# EAGLE design ASD2302 (EAGLE 6.3)
DATABASE: ./../../../../../Components/TinyCircuits_Part_Database.txt
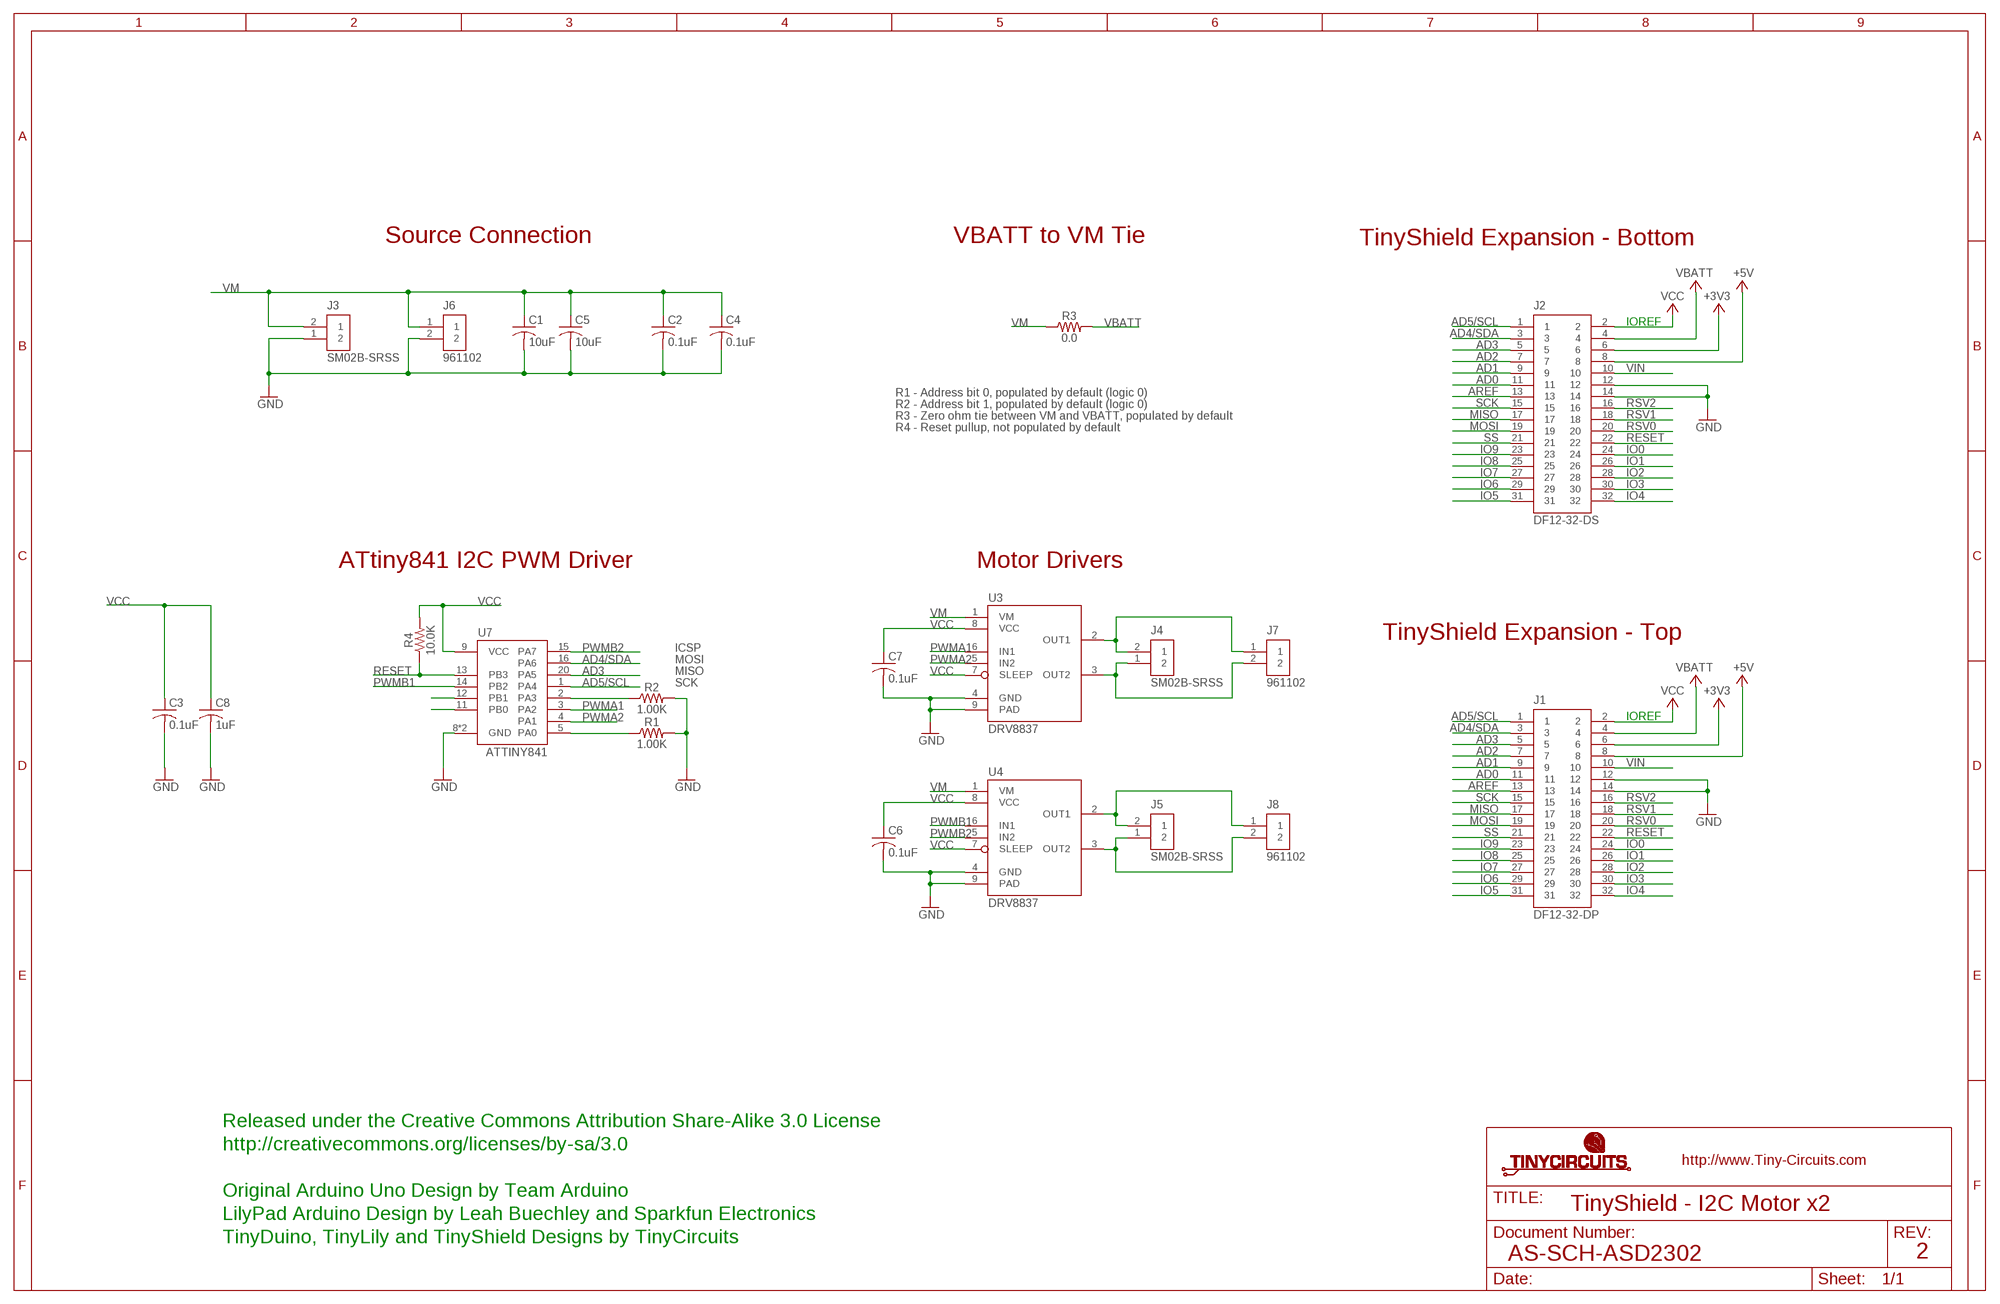
[diagram p0: schematic, sheet 1]

## Parts
C1  10uF  AS-ITM-00045  [C0805]
C2  0.1uF  AS-ITM-00008  [C0402]
C3  0.1uF  AS-ITM-00008  [C0402]
C4  0.1uF  AS-ITM-00008  [C0402]
C5  10uF  AS-ITM-00045  [C0805]
C6  0.1uF  AS-ITM-00008  [C0402]
C7  0.1uF  AS-ITM-00008  [C0402]
C8  1uF  AS-ITM-00105  [C0402]
J1  DF12-32-DP  AS-ITM-00015  [DF12-32-DP]
J2  DF12-32-DS  AS-ITM-00012  [DF12-32-DS]
J3  SM02B-SRSS  AS-ITM-00231  [JST_SH_2X1]
J4  SM02B-SRSS  AS-ITM-00231  [JST_SH_2X1]
J5  SM02B-SRSS  AS-ITM-00231  [JST_SH_2X1]
J6  961102  AS-ITM-00044  [2X.1"]
J7  961102  AS-ITM-00044  [2X.1"]
J8  961102  AS-ITM-00044  [2X.1"]
R1  1.00K  AS-ITM-00003  [0402]
R2  1.00K  AS-ITM-00003  [0402]
R3  0.0  AS-ITM-00076  [0402]
R4  10.0K  AS-ITM-00032  [0402]
U3  DRV8837  AS-ITM-00042  [WSON-8]
U4  DRV8837  AS-ITM-00042  [WSON-8]
U7  ATTINY841  AS-ITM-00255  [VQFN-20]

## Nets
+3V3: J1.6 J2.6
+5V: J1.8 J2.8
AD0: J1.11 J2.11
AD1: J1.9 J2.9
AD2: J1.7 J2.7
AD3: J1.5 J2.5 U7.20(PA5)
AD4/SDA: J1.3 J2.3 U7.16(PA6)
AD5/SCL: J1.1 J2.1 U7.1(PA4)
AREF: J1.13 J2.13
GND: C1.2 C2.2 C3.2 C4.2 C5.2 C6.2 C7.2 C8.2 J1.12 J1.14 J2.12 J2.14 J3.1 J6.2 R1.2 R2.2 U3.4(GND) U3.9(PAD) U4.4(GND) U4.9(PAD) U7.8(GND) U7.PAD(GND)
IO0: J1.24 J2.24
IO1: J1.26 J2.26
IO2: J1.28 J2.28
IO3: J1.30 J2.30
IO4: J1.32 J2.32
IO5: J1.31 J2.31
IO6: J1.29 J2.29
IO7: J1.27 J2.27
IO8: J1.25 J2.25
IO9: J1.23 J2.23
MISO: J1.17 J2.17
MOSI: J1.19 J2.19
N$1: U7.12(PB1)
N$2: U7.11(PB0)
N$3: J5.1 J8.2 U4.3(OUT2)
N$4: J5.2 J8.1 U4.2(OUT1)
N$6: J4.2 J7.1 U3.2(OUT1)
N$7: J4.1 J7.2 U3.3(OUT2)
N$15: R2.1 U7.2(PA3)
N$16: R1.1 U7.5(PA0)
PWMA1: U3.6(IN1) U7.3(PA2)
PWMA2: U3.5(IN2) U7.4(PA1)
PWMB1: U4.6(IN1) U7.14(PB2)
PWMB2: U4.5(IN2) U7.15(PA7)
RESET: J1.22 J2.22 R4.1 U7.13(PB3)
RSV0: J1.20 J2.20
RSV1: J1.18 J2.18
RSV2: J1.16 J2.16
SCK: J1.15 J2.15
SS: J1.21 J2.21
VBATT: J1.4 J2.4 R3.2
VCC: C3.1 C6.1 C7.1 C8.1 J1.2 J2.2 R4.2 U3.7(SLEEP) U3.8(VCC) U4.7(SLEEP) U4.8(VCC) U7.9(VCC)
VIN: J1.10 J2.10
VM: C1.1 C2.1 C4.1 C5.1 J3.2 J6.1 R3.1 U3.1(VM) U4.1(VM)

## Notes on the sheet
- Source Connection | VBATT to VM Tie | TinyShield Expansion - Bottom
- IOREF
- R1 - Address bit 0, populated by default (logic 0)
- R2 - Address bit 1, populated by default (logic 0)
- R3 - Zero ohm tie between VM and VBATT, populated by default
- R4 - Reset pullup, not populated by default
- ATtiny841 I2C PWM Driver | Motor Drivers
- TinyShield Expansion - Top
- ICSP
- MOSI
- MISO
- SCK
- IOREF
- Released under the Creative Commons Attribution Share-Alike 3.0 License
- http://creativecommons.org/licenses/by-sa/3.0
- Original Arduino Uno Design by Team Arduino
- TinyShield - I2C Motor x2
- LilyPad Arduino Design by Leah Buechley and Sparkfun Electronics
- TinyDuino, TinyLily and TinyShield Designs by TinyCircuits
- AS-SCH-ASD2302 | 2

## Library data of the parts
C1 C5 = tinycircuits:AS-ITM-00045: CAP CER 16UF 16V 20% X5R 0805; PARTNO: AS-ITM-00045
C2-C4 C6 C7 = tinycircuits:AS-ITM-00008: CAP CER 0.1UF 16V 10% X5R 0402; PARTNO: AS-ITM-00008
C8 = tinycircuits:AS-ITM-00105: CAP CER 1UF 6.3V 10% X5R 0402; PARTNO: AS-ITM-00105
J1 = tinycircuits:AS-ITM-00015: CONN HEADER 32POS 3MM SMD 0.5MM; PARTNO: AS-ITM-00015
J2 = tinycircuits:AS-ITM-00012: CONN RECEPT 32POS 3MM SMD 0.5MM; PARTNO: AS-ITM-00012
J3-J5 = tinycircuits:AS-ITM-00231: CONN HEADER SH 2POS SIDE 1MM; PARTNO: AS-ITM-00231; VALUE: SM02B-SRSS-TB(LF)(SN)
J6-J8 = tinycircuits:AS-ITM-00044: CONN HEADER R/A SGL 2POS GOLD; PARTNO: AS-ITM-00044
R1 R2 = tinycircuits:AS-ITM-00003: RES 1.00K OHM 1/16W 1% 0402; PARTNO: AS-ITM-00003
R3 = tinycircuits:AS-ITM-00076: RES 0.0 OHM 1/16W 1% 0402 SMD; PARTNO: AS-ITM-00076
R4 = tinycircuits:AS-ITM-00032: RES 10.0K OHM 1/16W 1% 0402 SMD; PARTNO: AS-ITM-00032
U3 U4 = tinycircuits:AS-ITM-00042: IC PWM MOTR DVR H-BRDG 8WSON; PARTNO: AS-ITM-00042
U7 = tinycircuits:AS-ITM-00255: IC MCU 8BIT 8KB FLASH 20VQFN; PARTNO: AS-ITM-00255

## Board
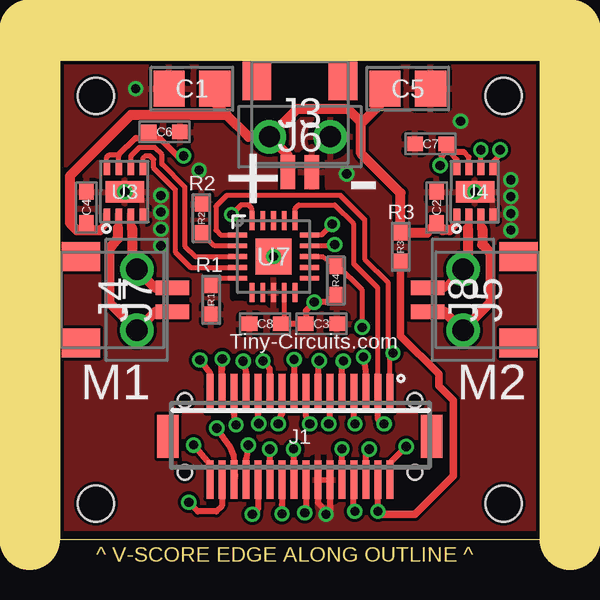
[diagram p1: board, top side]
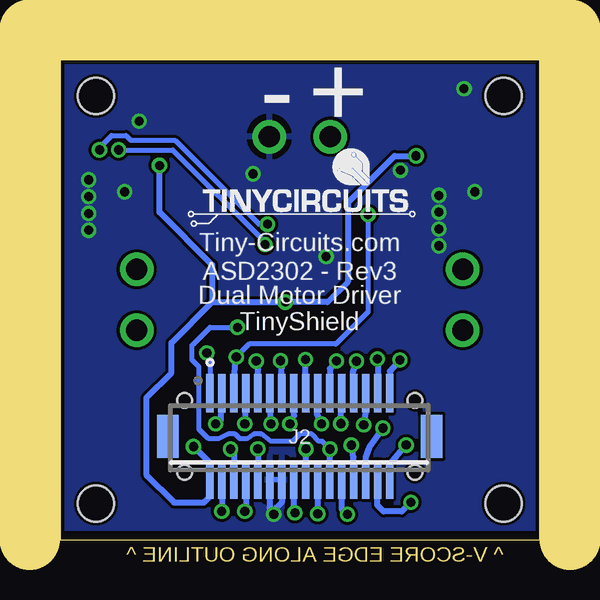
[diagram p2: board, bottom side, seen from below]

Size 20 x 20 mm. Coordinates in mm from the lower left corner, seen from the top.
Outline: 0,20 20,20 20,0 0,0 0,20
Copper layers (1*16): Top 0.035mm / dielectric 1.5mm / Bottom 0.035mm
Design rules "default *": minimum track width 5mil, minimum drill 15mil, track to track 5mil, track to pad 5mil, pad to pad 5mil, via to via 6mil, smd to smd 5mil, copper to edge 6mil, drill to drill 8mil, minimum pad ring 10mil, minimum via ring 5mil, stop-mask expansion 4mil, vias tented up to drill 25mil, thermal gap 10mil
Holes 1.5 mm at 1.5,18.5 18.5,18.5 18.5,1.5 1.5,1.5
tRestrict: area 8,10.9 to 9.7,12.7; 7 lines
bRestrict: 1 lines
Milling: 3 lines

### Footprints (pad centres in the part's own frame; a part is rotated, then mirrored left to right if it is on the bottom)
C0805 = smd 1.3 x 1.5: 1 -0.95,0; 2 0.95,0
C0402 = smd 0.65 x 0.6: 1 -0.65,0; 2 0.65,0
DF12-32-DP = smd 0.3 x 1.6: 1 -3.75,-1.8; 2 -3.75,1.8; 3 -3.25,-1.8; 4 -3.25,1.8; 5 -2.75,-1.8; 6 -2.75,1.8; 7 -2.25,-1.8; 8 -2.25,1.8; 9 -1.75,-1.8; 10 -1.75,1.8; 11 -1.25,-1.8; 12 -1.25,1.8; 13 -0.75,-1.8; 14 -0.75,1.8; 15 -0.25,-1.8; 16 -0.25,1.8; 17 0.25,-1.8; 18 0.25,1.8; 19 0.75,-1.8; 20 0.75,1.8; 21 1.25,-1.8; 22 1.25,1.8; 23 1.75,-1.8; 24 1.75,1.8; 25 2.25,-1.8; 26 2.25,1.8; 27 2.75,-1.8; 28 2.75,1.8; 29 3.25,-1.8; 30 3.25,1.8; 31 3.75,-1.8; 32 3.75,1.8 | smd 0.9 x 1.8: F1 -5.5,0; F2 5.5,0 | hole 0.6: -4.8,1.5; 4.8,1.5
DF12-32-DS = smd 0.3 x 1.6: 1 -3.75,1.8; 2 -3.75,-1.8; 3 -3.25,1.8; 4 -3.25,-1.8; 5 -2.75,1.8; 6 -2.75,-1.8; 7 -2.25,1.8; 8 -2.25,-1.8; 9 -1.75,1.8; 10 -1.75,-1.8; 11 -1.25,1.8; 12 -1.25,-1.8; 13 -0.75,1.8; 14 -0.75,-1.8; 15 -0.25,1.8; 16 -0.25,-1.8; 17 0.25,1.8; 18 0.25,-1.8; 19 0.75,1.8; 20 0.75,-1.8; 21 1.25,1.8; 22 1.25,-1.8; 23 1.75,1.8; 24 1.75,-1.8; 25 2.25,1.8; 26 2.25,-1.8; 27 2.75,1.8; 28 2.75,-1.8; 29 3.25,1.8; 30 3.25,-1.8; 31 3.75,1.8; 32 3.75,-1.8 | smd 0.9 x 1.8: F1 -5.5,0; F2 5.5,0 | hole 0.6: -4.8,1.5; 4.8,1.5
JST_SH_2X1 = smd 0.6 x 1.4: 1 -0.5,2.475; 2 0.5,2.475 | smd 1.2 x 1.6: PAD1 -1.8,-1.325; PAD2 1.8,-1.325
2X.1" = drill 0.889 pad 1.397: 1 -1.27,0; 2 1.27,0
0402 = smd 0.65 x 0.55: 1 -0.6,0; 2 0.6,0
WSON-8 = smd 0.28 x 0.5: 1 -0.75,-0.95; 2 -0.25,-0.95; 3 0.25,-0.95; 4 0.75,-0.95; 5 0.75,0.95; 6 0.25,0.95; 7 -0.25,0.95; 8 -0.75,0.95 | smd 1.6 x 0.9: 9 0,0
VQFN-20 = smd 0.8 x 0.2: 1 -1.5,0.9; 2 -1.5,0.45; 3 -1.5,0; 4 -1.5,-0.45; 5 -1.5,-0.9; 11 1.5,-0.9; 12 1.5,-0.45; 13 1.5,0; 14 1.5,0.45; 15 1.5,0.9 | smd 0.2 x 0.8: 6 -0.9,-1.5; 7 -0.45,-1.5; 8 0,-1.5; 9 0.45,-1.5; 10 0.9,-1.5; 16 0.9,1.5; 17 0.45,1.5; 18 0,1.5; 19 -0.45,1.5; 20 -0.9,1.5 | smd 1.5 x 1.5: PAD 0,0

### Placement (x,y rotation side)
C1  5.5,18.8 180 top
C2  15.7,13.85 90 top
C3  10.9,9 0 top
C4  1.1,13.85 90 top
C5  14.5,18.8 0 top
C6  4.35,17 0 top
C7  15.45,16.5 180 top
C8  8.55,9 180 top
J1  10,4.3 180 top
J2  10,4.3 0 bottom
J3  10,17.8 180 top
J4  2.2,10 270 top
J5  17.8,10 90 top
J6  10,16.8 0 top
J7  3.2,10 90 top
J8  16.8,10 270 top
R1  6.3,10 270 top
R2  5.9,13.4 90 top
R3  14.2,12.2 270 top
R4  11.5,10.8 270 top
U3  2.7,14.5 0 top
U4  17.3,14.5 0 top
U7  8.9,11.8 0 top
U$1  [DOCFIELD-TINYCIRCUITS-PCB]  33.91,-10 0 top  (outside the outline)

### Tracks (layer width: path | path; a pad name or v marks a point on that pad's centre or on a via)
+3V3  (via drill 0.38)
  Top 0.254: J2.6 12.75,3.47 v12.89,3.77
  Bottom 0.254: v12.89,3.77 12.74,3.51 J2.6
+5V  (via drill 0.38)
  Top 0.254: v12.29,1.18 12.24,1.34 J2.8
  Bottom 0.254: J2.8 12.25,1.31 v12.29,1.18
AD0  (via drill 0.38)
  Top 0.254: v11.2,4.83 11.26,5.05 J2.11
  Bottom 0.254: J2.11 11.23,5.09 v11.2,4.83
AD1  (via drill 0.38)
  Top 0.254: J2.9 11.74,7.12 v11.81,7.44
  Bottom 0.254: v11.81,7.44 11.73,7.07 J2.9
AD2  (via drill 0.38)
  Top 0.254: v12.29,4.83 12.26,5.05 J2.7
  Bottom 0.254: J2.7 12.27,5.06 v12.29,4.83
AD3  (via drill 0.38)
  Top 0.203: U7.20 8,13.8 7.85,13.95 7.55,13.95 v7.15,13.55
  Top 0.254: J2.5 12.73,7.04 v12.65,7.61
  Bottom 0.203: v7.15,13.55 7.15,9.5 8.5,8.15 12.11,8.15 v12.65,7.61
  Bottom 0.254: v12.65,7.61 12.78,6.3 J2.5
AD4/SDA  (via drill 0.38)
  Top 0.203: 13.27,6.12 J2.3 13.25,10.5 12.25,11.5 12.25,13.15 11.45,13.95 9.95,13.95 9.8,13.8 U7.16
  Top 0.254: v13.51,4.83 13.26,5 J2.3
  Bottom 0.254: J2.3 13.28,4.96 v13.51,4.83
AD5/SCL  (via drill 0.38)
  Top 0.203: J2.1 13.75,7.65 v13.88,7.78 13.68,7.97 13.68,10.72 12.7,11.7 12.7,13.35 11.7,14.35 6.95,14.35 6.5,13.9 6.5,12.9 6.7,12.7 U7.1
  Bottom 0.203: v13.88,7.78 13.75,7.66 J2.1
AREF  (via drill 0.38)
  Top 0.254: J2.13 10.75,7.15 v10.8,7.46
  Bottom 0.254: v10.8,7.46 10.76,7.14 J2.13
GND  (via drill 0.38)
  Top 0.203: J2.12 J2.14 | 11.25,1.09 v11.08,1.05 | 10.45,15.27 J3.1
  Top 0.254: J2.12 11.25,1.09 | 10.75,2.15 10.75,1.55 11.05,1.25
  Bottom 0.203: v11.08,1.05 11.25,1.09 | J2.14 J2.12
  Bottom 0.254: 11.25,1.09 J2.12 | 10.75,2.05 10.75,1.55 11.1,1.2
  other vias: 4.2,14.35 4.2,13.65 4.2,12.95 18.8,12.9 18.8,13.6 18.8,14.3 18.8,15 4.2,12.25 3.15,18.8 11.95,15.25 16.7,17.45 8.9,11.8 5.8,15.4 2.7,14.5 17.3,14.5
  pour Top: 0,20 20,20 20,0 0,0
  pour Bottom: 0,20 20,20 20,0 0,0
IO0  (via drill 0.38)
  Top 0.254: J2.24 8.25,1.26 v8.01,1.05
  Bottom 0.254: J2.24 8.25,1.27 8.1,1.02 v8.01,1.05
IO1  (via drill 0.38)
  Top 0.254: v7.85,3.94 7.75,3.34 7.75,3.35 J2.26
  Bottom 0.254: 7.75,2.91 J2.26 7.75,3.44 v7.85,3.94
IO2  (via drill 0.38)
  Top 0.254: v6.53,4.64 7.07,3.89 7.22,3.49 7.29,2.61 7.26,2.51 J2.28
  Bottom 0.254: J2.28 7.24,3.43 7.07,3.88 v6.53,4.64
IO3  (via drill 0.38)
  Top 0.254: J2.30 6.75,1.42 6.51,1.18 5.75,1.18 v5.37,1.56
  Bottom 0.254: v5.37,1.56 5.75,1.18 6.51,1.18 6.76,1.43 6.76,2.49 J2.30
IO4  (via drill 0.38)
  Top 0.254: J2.32 6.25,3.14 v5.56,3.94
  Bottom 0.254: v5.56,3.94 5.61,3.91 6.21,3.18 6.21,3.14 6.26,3.1 J2.32
IO5  (via drill 0.38)
  Top 0.254: v5.83,7.49 5.95,7.34 6.25,6.95 6.23,6.38 J2.31
  Bottom 0.254: J2.31 6.24,7.02 v5.83,7.49
IO6  (via drill 0.38)
  Top 0.254: J2.29 6.75,7.3 6.74,6.8 6.74,7.28 v6.77,7.54
  Bottom 0.254: v6.77,7.54 6.74,7.13 J2.29
IO7  (via drill 0.38)
  Top 0.254: v7.33,4.78 7.26,5.25 J2.27
  Bottom 0.254: J2.27 7.24,5.31 v7.33,4.78
IO8  (via drill 0.38)
  Top 0.203: 7.76,6.11 J2.25
  Top 0.254: v7.64,7.44 v7.65,7.44 7.75,6.95 7.76,6.11
  Bottom 0.254: J2.25 7.77,6.97 v7.64,7.44
IO9  (via drill 0.38)
  Top 0.254: v8.29,4.83 8.26,5.23 J2.23
  Bottom 0.254: J2.23 8.28,4.98 v8.29,4.83
MISO  (via drill 0.38)
  Top 0.254: v9.76,7.51 9.75,7.46 J2.17
  Bottom 0.203: J2.17 9.76,6.11
  Bottom 0.254: 9.76,6.11 v9.76,7.51
MOSI  (via drill 0.38)
  Top 0.254: v9.1,4.83 9.26,5.25 J2.19
  Bottom 0.254: J2.19 9.27,5.26 v9.1,4.83
N$3
  Top 0.203: 17.6,12.98 17.57,13.02 17.55,12.95
  Top 0.305: 17.55,12.95 U4.3
  Top 0.406: J5.1 16.03,9.5 J8.2 17.95,9.88 17.95,11.95 17.6,12.3 17.6,12.98
N$4
  Top 0.203: 17,12.98 17,13.1 17.05,13
  Top 0.305: 17.05,13 U4.2 | J5.2 16.03,10.5 J8.1
  Top 0.406: 17,12.98 17,11.47 J8.1
N$6
  Top 0.305: U3.2 2.45,13 2.4,13
  Top 0.406: 2.4,13 2.4,12.55 2.05,12.1 2.05,9.88 J7.1 3.97,9.5 J4.2
N$7
  Top 0.305: 3,13 2.95,12.95 U3.3
  Top 0.406: 3,13 3,11.47 J7.2 3.97,10.5 J4.1
N$15
  Top 0.203: U7.2 6.45,12.25 R2.1
N$16
  Top 0.203: R1.1 6.3,10.9 U7.5
PWMA1
  Top 0.203: U3.6 2.95,16 3.3,16.35 3.95,16.35 4.25,16.05 4.25,15.65 5.2,14.7 5.2,12.25 5.65,11.8 U7.3
PWMA2
  Top 0.203: U3.5 3.45,15.9 3.55,16 3.75,16 3.9,15.85 3.9,15.5 4.8,14.6 4.8,12 5.45,11.35 U7.4
PWMB1  (via drill 0.38)
  Top 0.203: U4.6 v17.55,16.25 | v11.45,12.3 11.4,12.25 U7.14
  Bottom 0.203: v17.55,16.25 15.3,16.25 11.45,12.4 v11.45,12.3
PWMB2  (via drill 0.38)
  Top 0.203: U4.5 18.05,15.75 18.35,16.05 v18.35,16.25 | v11.35,13.15 10.9,12.7 U7.15
  Bottom 0.203: v18.35,16.25 18.35,16.35 17.85,16.85 17.25,16.85 17.05,16.65 15.2,16.65 11.7,13.15 v11.35,13.15
RESET  (via drill 0.38)
  Top 0.203: U7.13 10.95,11.8 R4.1 11.55,11.45 12.6,10.4 v12.6,8.85
  Top 0.254: v8.74,3.77 J2.22
  Bottom 0.203: v8.74,3.77 9.07,4.1 9.2,4.1 9.5,4.4 10,4.4 10.3,4.1 11.2,4.1 11.6,4.4 11.9,4.4 12.2,4.2 12.5,4.2 12.7,4.4 13,4.4 13.4,4.2 13.8,4.2 14.2,4.6 14.2,7.2 14.5,7.5 14.5,8.1 13.75,8.85 v12.6,8.85
  Bottom 0.254: J2.22 8.75,3.69 v8.74,3.77
RSV0  (via drill 0.38)
  Top 0.254: J2.20 9.25,1.45 v9.25,1.07
  Bottom 0.254: J2.20 9.25,1.27 v9.25,1.07
RSV1  (via drill 0.38)
  Top 0.254: v9.74,3.77 9.74,2.51 J2.18
  Bottom 0.254: J2.18 9.75,3.72 v9.74,3.77
RSV2  (via drill 0.38)
  Top 0.254: J2.16 10.25,1.16 v10.2,1.12
  Bottom 0.254: v10.2,1.12 10.22,1.12 10.25,1.15 J2.16
SCK  (via drill 0.38)
  Top 0.254: v10.41,4.83 10.26,5.13 J2.15
  Bottom 0.254: J2.15 10.24,5.16 v10.41,4.83
SS  (via drill 0.38)
  Top 0.254: J2.21 8.75,7.12 v8.46,7.45
  Bottom 0.254: v8.46,7.45 8.75,7.12 J2.21
VBATT  (via drill 0.38)
  Top 0.254: v13.25,1.18 J2.4
  Top 0.305: R3.2 14.2,8.5 15.8,6.9 15.8,6.4 16.4,5.8 16.4,2.65 14.8,1.05 13.43,1.05 v13.25,1.18
  Bottom 0.254: J2.4 13.25,1.24 v13.25,1.18
VCC  (via drill 0.38)
  Top 0.203: U3.8 1.95,15.95 2.05,16.05 2.45,16.05 U3.7 | U4.8 16.55,15.85 16.25,16.15 16.05,16.15 16.15,16.25 | U4.7 17.05,15.95 16.85,16.15 | C3.1 10.15,8.9 10.1,9 | C8.1 9.35,9.1 U7.9
  Top 0.254: 16.05,16.15 15.9,16 15.9,15.65 v15.85,15.6 | 2.45,16.05 3.15,16.75 3.6,16.75 | 3.6,16.75 4.15,16.75 4.9,16 v5.15,16 | 16.85,16.15 16.25,16.15 | J2.2 13.75,3.19 v14.43,3.88 | C7.1 16.15,16.25 | C6.1 3.6,16.75 | C3.1 10.25,9.55 v10.6,9.9 11.1,9.9 R4.2 | 10.1,9 C8.1
  Bottom 0.254: v5.15,16 6.05,16 8,14.05 8,10.75 8.85,9.9 v10.6,9.9 | v14.43,3.88 13.75,3.19 J2.2 13.75,1.8 14,1.55 15.25,1.55 16.4,2.7 16.4,5.9 15.35,6.95 15.35,8.2 13.65,9.9 | 13.65,9.9 v10.6,9.9 | 11.7,9.9 v10.6,9.9 | 13.65,9.9 13.65,11.45 15.85,13.65 v15.85,15.6
VIN  (via drill 0.38)
  Top 0.254: J2.10 v11.76,3.78 v11.75,3.78
  Bottom 0.254: v11.75,3.78 J2.10
VM
  Top 0.203: 6.1,18.5 C1.1
  Top 0.305: U4.1 16.55,13.2 16.25,12.9 | U3.1 1.95,13.2 1.65,12.9
  Top 0.406: J3.2 9.5,16.03 J6.1 | 12.55,17.35 12.55,16.1 14.2,14.45 R3.1 15.3,12.8 C2.1 15.95,12.9 16.25,12.9 | 12.55,17.35 12.55,17.4 12,17.95 9.88,17.95 J6.1 | C5.1 14,18.8 12.55,17.35 | J6.1 7.85,16.8 6.95,17.7 | 6.95,17.7 2.95,17.7 0.4,15.15 0.4,13.2 0.7,12.9 1.15,12.9 | 1.15,12.9 1.65,12.9 | C4.1 1.1,12.95 1.15,12.9 | 6.95,17.7 6.1,18.55 C1.1

### Text on the board
Dimension: ^ V-SCORE EDGE ALONG OUTLINE ^
tPlace: R2 | + | - | R3 | R1 | Tiny-Circuits.com | M1 | M2
bPlace: + | - | Tiny-Circuits.com | ASD2302 - Rev3 | Dual Motor Driver | TinyShield
Document: FABRICATION DRAWING | NOTES: | 1. PRINTED CIRCUIT BOARD MADE FROM NEMA GRADE FR-4 EPOXY LAMINATE | WITH 1 OUNCE COPPER PLATING AND .024 THICKNESS. | 2. ALL DIMENSIONS ARE GIVEN IN INCHES. | 3. CIRCUIT PATHS ARE FOR REFERENCE ONLY. | 4. HOLE SIZES SHOWN ARE FINISHED DIAMETERS AFTER PLATING. | 5. BOARD PLATED USING REFLOW OR SIMILAR METHOD. | 6. BOARD TO HAVE BLUE SOLDER MASK ON PLATED SURFACES USING WET FILM | 7. SILKSCREEN BOARD USING WHITE INK. | SR100 OR SR1010 EPOXY. EQUIVALENT WET OR DRY FILM MAY BE USED. | 8. THE FOLLOWING INFORMATION APPLIES TO THIS BOARD: | * 2 COPPER LAYERS | * .024 BOARD THICKNESS | * REQUIRES TOP SIDE SILKSCREEN | Released under the Creative Commons Attribution Share-Alike 3.0 License | http://creativecommons.org/licenses/by-sa/3.0 | Original Arduino Uno Design by Team Arduino | LilyPad Arduino Design by Leah Buechley and Sparkfun Electronics | TinyDuino, TinyLily and TinyShield Designs by TinyCircuits | TinyShield - I2C Motor x2 | AS-PCB-ASD2302 | 3